# Altium schematic sheet Driver.SchDoc
size A
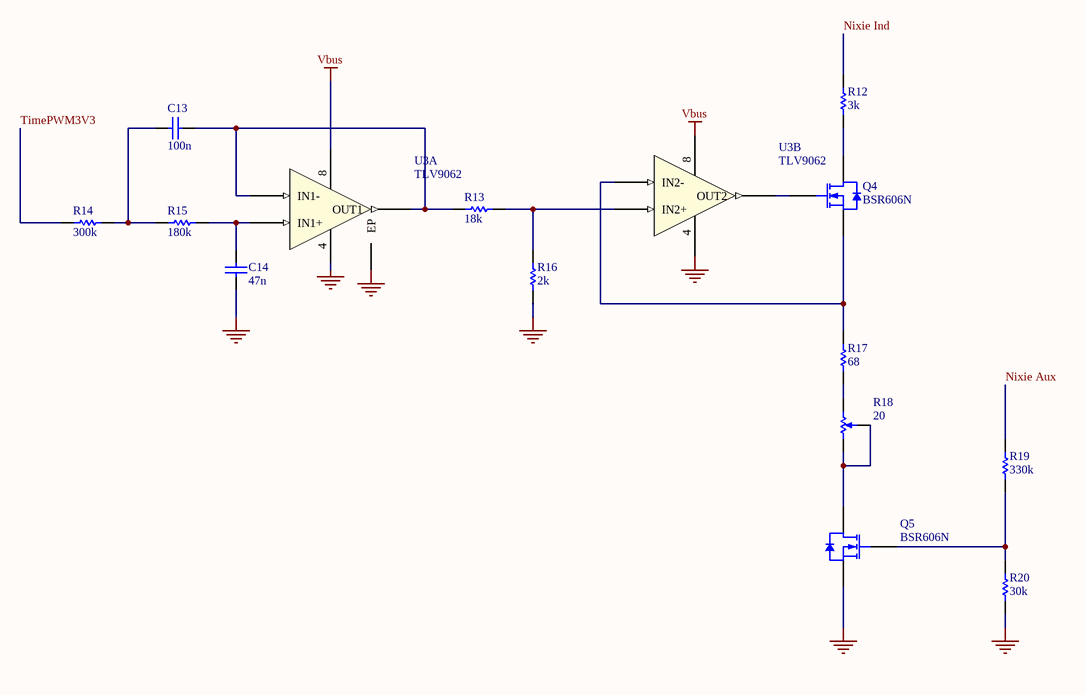
[diagram p0: Driver.SchDoc]

## Parts
C13  100n  [CAPC0402(1005)60_N]
C14  47n  [CAPC0402(1005)60_N]
Q4  BSR606N  [INF-PG-SC59_N]
Q5  BSR606N  [INF-PG-SC59_N]
R12  3k  [RESC0402(1005)_N]
R13  18k  [RESC0402(1005)_N]
R14  300k  [RESC0402(1005)_N]
R15  180k  [RESC0402(1005)_N]
R16  2k  [RESC0402(1005)_N]
R17  68  [RESC0402(1005)_N]
R18  20  [PVG3A]
R19  330k  [RESC0402(1005)_N]
R20  30k  [RESC0402(1005)_N]
U3  TLV9062  [WSON-8]  (parts A,B of 2)

## Nets
GND: C14.1 Q5.2(SOURCE) R16.1 R20.1 U3.4(V-) U3.9(EP)
Vbus: U3.8(V+)
Nixie Aux: R19.2
Nixie Ind: R12.2
TimePWM3V3: R14.1
NetC13_1: C13.1 R14.2 R15.1
NetC13_2: C13.2 R13.1 U3.1(OUT1) U3.2(IN1-)
NetC14_2: C14.2 R15.2 U3.3(IN1+)
NetQ4_1: Q4.1(GATE) U3.7(OUT2)
NetQ4_2: Q4.2(SOURCE) R17.2 U3.6(IN2-)
NetQ4_3: Q4.3(DRAIN) R12.1
NetQ5_1: Q5.1(GATE) R19.1 R20.2
NetQ5_3: Q5.3(DRAIN) R18.1 R18.2
NetR13_2: R13.2 R16.2 U3.5(IN2+)
NetR17_1: R17.1 R18.3

## Library data of the parts
C13 = AC0402KRX7R7BB104: CAP CER 0.1UF 16V X7R 0402; Manufacturer: Yageo; Tolerance: ±10%; Supplier 1: Digi-Key; Manufacturer Part Number: AC0402KRX7R7BB104; RoHS: RoHS Compliant; Category: Capacitors; Stock 1: 29133; Pricing 1: 1=0.1, 10=0.068, 100=0.0304, 500=0.02174, 1000=0.01708, 2500=0.01553, 5000=0.01429 (USD); Packaging: Cut Tape (CT); Part Status: Active; Voltage - Rated: 16V; Temperature Coefficient: X7R; Operating Temperature: -55°C ~ 125°C; Features: -; Ratings: AEC-Q200; Applications: Automotive; Failure Rate: -; Mounting Type: Surface Mount, MLCC; Package / Case: 0402 (1005 Metric); Size / Dimension: 0.039" L x 0.020" W (1.00mm x 0.50mm); Height - Seated (Max): -; Thickness (Max): 0.022" (0.55mm); Lead Spacing: -; Lead Style: -; ComponentLink1URL: http://www.yageo.com/documents/recent/UPY-AC_NP0X7R_16V-to-630V_11.pdf; ComponentLink1Description: http://www.yageo.com/documents/recent/UPY-AC_NP0X7R_16V-to-630V_11.pdf; Supplier Part Number 1: 311-3026-1-ND
C14 = AC0402KRX7R7BB473: CAP CER 0.047UF 16V X7R 0402; Manufacturer: Yageo; Tolerance: ±10%; Supplier 1: Digi-Key; Manufacturer Part Number: AC0402KRX7R7BB473; RoHS: RoHS Compliant; Category: Capacitors; Stock 1: 7700; Pricing 1: 1=0.13, 10=0.093, 100=0.0416, 500=0.0297, 1000=0.02334, 2500=0.02122, 5000=0.01952 (USD); Packaging: Cut Tape (CT); Part Status: Active; Voltage - Rated: 16V; Temperature Coefficient: X7R; Operating Temperature: -55°C ~ 125°C; Features: -; Ratings: AEC-Q200; Applications: Automotive; Failure Rate: -; Mounting Type: Surface Mount, MLCC; Package / Case: 0402 (1005 Metric); Size / Dimension: 0.039" L x 0.020" W (1.00mm x 0.50mm); Height - Seated (Max): -; Thickness (Max): 0.022" (0.55mm); Lead Spacing: -; Lead Style: -; ComponentLink1URL: http://www.yageo.com/documents/recent/UPY-AC_NP0X7R_16V-to-630V_11.pdf; ComponentLink1Description: http://www.yageo.com/documents/recent/UPY-AC_NP0X7R_16V-to-630V_11.pdf; Supplier Part Number 1: 311-3064-1-ND
Q4 Q5 = BSR606N: N-Channel OptiMOS(TM)-3 Small-Signal-Transistor, 60 V VDS, 2.3 A ID, -55 to 150 degC, PG-SC59, Reel, Green; Manufacturer: Infineon; Manufacturer Part Number: BSR606NH6327XTSA1; ID (max): 2.3Â A; IDpuls (max): 9.1Â A; RthJA (max): 250Â K/W; VDS (max): 60Â V; Green: TRUE; Polarity: FALSE; Ptot (max): 0.5Â W; VGS(th) (min): 1.3Â V; QG: 3.7Â nC; VGS(th) (max): 2.3Â V; Mode: Enhancement; Continuous Drain Current (ID): 2.3A; Drain to Source Voltage (Vdss): 60V; Drain to Source Resistance: 60mR; Max Power Dissipation: 500mW; Input Capacitance: 657pF; Number of Elements: 1; Threshold Voltage: 1.8V; Element Configuration: Single; Gate to Source Voltage (Vgs): 20V; ComponentLink2URL: http://www.infineon.com/dgdl/BSR606N_2+3.pdf?folderId=db3a3043156fd573011622e10b5c1f67&fileId=db3a30433e78ea82013e7ea9a659062b; PackageDescription: 3-Pin Semiconductor Package, 3 x 1.53 mm Body, 0.95 mm Pitch; ComponentLink1Description: Manufacturer URL; PackageVersion: Mar-08; Packing: Reel; PartNumber: BSR606N; DatasheetVersion: Rev. 2.3; ComponentLink1URL: http://www.infineon.com/; ComponentLink2Description: Datasheet; ComponentLink3Description: Package Specification; Mounting: SMD; Mounting Technology: Surface Mount; PackageReference: PG-SC59; ComponentLink3URL: http://www.infineon.com/dgdl/SC59-Package_Overview.pdf?folderId=db3a30431936bc4b01194dc0d34440b0&fileId=db3a30431936bc4b01194dd1aa1d40cf; Halogen-free: TRUE; Supplier 1: Digi-Key; Stock 1: 131; Pricing 1: 1=0.61, 10=0.517, 100=0.3875, 500=0.28416, 1000=0.21958 (USD); Mount: Surface Mount; Case/Package: SC; Number of Pins: 59; Min Operating Temperature: -55°C; Max Operating Temperature: 150°C; Packaging: Tape and Reel; Package Quantity: 3000; Rds On Max: 60mR; Power Dissipation: 500mW; Max Dual Supply Voltage: 60V; REACH SVHC: No SVHC; Lead Free: Lead Free; Halogen Free: Halogen Free; Supplier Part Number 1: BSR606NH6327XTSA1CT-ND
R12 = RC0402FR-073KL: RES SMD 3K OHM 1% 1/16W 0402; Manufacturer: Yageo; Power (Watts): 0.063W, 1/16W; Temperature Coefficient: ±100ppm/°C; Supplier 1: Digi-Key; Manufacturer Part Number: RC0402FR-073KL; RoHS: RoHS Compliant; Category: Resistors; Stock 1: 3701800; Pricing 1: 1=0.1, 10=0.018, 100=0.0076, 1000=0.00356, 2500=0.00313, 5000=0.00263 (USD); Packaging: Cut Tape (CT); Part Status: Active; Tolerance: ±1%; Composition: Thick Film; Features: Moisture Resistant; Operating Temperature: -55°C ~ 155°C; Package / Case: 0402 (1005 Metric); Supplier Device Package: 0402; Size / Dimension: 0.039" L x 0.020" W (1.00mm x 0.50mm); Height - Seated (Max): 0.016" (0.40mm); Failure Rate: -; ComponentLink1URL: http://www.yageo.com/documents/recent/PYu-RC_Group_51_RoHS_L_9.pdf; ComponentLink1Description: http://www.yageo.com/documents/recent/PYu-RC_Group_51_RoHS_L_9.pdf; Supplier Part Number 1: 311-3KLRCT-ND
R13 = RC0402FR-0718KL: RES SMD 18K OHM 1% 1/16W 0402; Manufacturer: Yageo; Power (Watts): 0.063W, 1/16W; Temperature Coefficient: ±100ppm/°C; Supplier 1: Digi-Key; Manufacturer Part Number: RC0402FR-0718KL; RoHS: RoHS Compliant; Category: Resistors; Stock 1: 0; Pricing 1: 1=0.1, 10=0.018, 100=0.0076, 1000=0.00356, 2500=0.00313, 5000=0.00263 (USD); Packaging: Cut Tape (CT); Part Status: Active; Tolerance: ±1%; Composition: Thick Film; Features: Moisture Resistant; Operating Temperature: -55°C ~ 155°C; Package / Case: 0402 (1005 Metric); Supplier Device Package: 0402; Size / Dimension: 0.039" L x 0.020" W (1.00mm x 0.50mm); Height - Seated (Max): 0.016" (0.40mm); Failure Rate: -; ComponentLink1URL: http://www.yageo.com/documents/recent/PYu-RC_Group_51_RoHS_L_9.pdf; ComponentLink1Description: http://www.yageo.com/documents/recent/PYu-RC_Group_51_RoHS_L_9.pdf; Supplier Part Number 1: 311-18.0KLRCT-ND
R14 = RC0402FR-07300KL: RES SMD 300K OHM 1% 1/16W 0402; Manufacturer: Yageo; Power (Watts): 0.063W, 1/16W; Temperature Coefficient: ±100ppm/°C; Supplier 1: Digi-Key; Manufacturer Part Number: RC0402FR-07300KL; RoHS: RoHS Compliant; Category: Resistors; Stock 1: 1397022; Pricing 1: 1=0.1, 10=0.018, 100=0.0076, 1000=0.00356, 2500=0.00313, 5000=0.00263 (USD); Packaging: Cut Tape (CT); Part Status: Active; Tolerance: ±1%; Composition: Thick Film; Features: Moisture Resistant; Operating Temperature: -55°C ~ 155°C; Package / Case: 0402 (1005 Metric); Supplier Device Package: 0402; Size / Dimension: 0.039" L x 0.020" W (1.00mm x 0.50mm); Height - Seated (Max): 0.016" (0.40mm); Failure Rate: -; ComponentLink1URL: http://www.yageo.com/documents/recent/PYu-RC_Group_51_RoHS_L_9.pdf; ComponentLink1Description: http://www.yageo.com/documents/recent/PYu-RC_Group_51_RoHS_L_9.pdf; Supplier Part Number 1: 311-300KLRCT-ND
R15 = RC0402FR-07180KL: RES SMD 180K OHM 1% 1/16W 0402; Manufacturer: Yageo; Power (Watts): 0.063W, 1/16W; Temperature Coefficient: ±100ppm/°C; Supplier 1: Digi-Key; Manufacturer Part Number: RC0402FR-07180KL; RoHS: RoHS Compliant; Category: Resistors; Stock 1: 0; Pricing 1: 1=0.1, 10=0.018, 100=0.0076, 1000=0.00356, 2500=0.00313, 5000=0.00263 (USD); Packaging: Cut Tape (CT); Part Status: Active; Tolerance: ±1%; Composition: Thick Film; Features: Moisture Resistant; Operating Temperature: -55°C ~ 155°C; Package / Case: 0402 (1005 Metric); Supplier Device Package: 0402; Size / Dimension: 0.039" L x 0.020" W (1.00mm x 0.50mm); Height - Seated (Max): 0.016" (0.40mm); Failure Rate: -; ComponentLink1URL: http://www.yageo.com/documents/recent/PYu-RC_Group_51_RoHS_L_9.pdf; ComponentLink1Description: http://www.yageo.com/documents/recent/PYu-RC_Group_51_RoHS_L_9.pdf; Supplier Part Number 1: 311-180KLRCT-ND
R16 = RC0402FR-072KL: RES SMD 2K OHM 1% 1/16W 0402; Manufacturer: Yageo; Power (Watts): 0.063W, 1/16W; Temperature Coefficient: ±100ppm/°C; Supplier 1: Digi-Key; Manufacturer Part Number: RC0402FR-072KL; RoHS: RoHS Compliant; Category: Resistors; Stock 1: 8929494; Pricing 1: 1=0.1, 10=0.018, 100=0.0076, 1000=0.00356, 2500=0.00313, 5000=0.00263 (USD); Packaging: Cut Tape (CT); Part Status: Active; Tolerance: ±1%; Composition: Thick Film; Features: Moisture Resistant; Operating Temperature: -55°C ~ 155°C; Package / Case: 0402 (1005 Metric); Supplier Device Package: 0402; Size / Dimension: 0.039" L x 0.020" W (1.00mm x 0.50mm); Height - Seated (Max): 0.016" (0.40mm); Failure Rate: -; ComponentLink1URL: http://www.yageo.com/documents/recent/PYu-RC_Group_51_RoHS_L_9.pdf; ComponentLink1Description: http://www.yageo.com/documents/recent/PYu-RC_Group_51_RoHS_L_9.pdf; Supplier Part Number 1: 311-2KLRCT-ND
R17 = RC0402FR-0768RL: RES SMD 68 OHM 1% 1/16W 0402; Manufacturer: Yageo; Power (Watts): 0.063W, 1/16W; Temperature Coefficient: ±100ppm/°C; Supplier 1: Digi-Key; Manufacturer Part Number: RC0402FR-0768RL; RoHS: RoHS Compliant; Category: Resistors; Stock 1: 0; Pricing 1: 1=0.1, 10=0.018, 100=0.0073, 1000=0.00329, 2500=0.00286, 5000=0.00236 (USD); Packaging: Cut Tape (CT); Part Status: Active; Tolerance: ±1%; Composition: Thick Film; Features: Moisture Resistant; Operating Temperature: -55°C ~ 155°C; Package / Case: 0402 (1005 Metric); Supplier Device Package: 0402; Size / Dimension: 0.039" L x 0.020" W (1.00mm x 0.50mm); Height - Seated (Max): 0.016" (0.40mm); Failure Rate: -; ComponentLink1URL: http://www.yageo.com/documents/recent/PYu-RC_Group_51_RoHS_L_9.pdf; ComponentLink1Description: http://www.yageo.com/documents/recent/PYu-RC_Group_51_RoHS_L_9.pdf; Supplier Part Number 1: 311-68.0LRCT-ND
R18 = PVG3A200C01R00: TRIMMER 20 OHM 0.25W J LEAD TOP; Manufacturer: Bourns Inc.; Power (Watts): 0.25W, 1/4W; Tolerance: ±20%; Temperature Coefficient: ±150ppm/°C; Adjustment Type: Top Adjustment; Resistive Material: Cermet; Supplier 1: Digi-Key; Manufacturer Part Number: PVG3A200C01R00; RoHS: RoHS Compliant; Category: Potentiometers, Variable Resistors; Stock 1: 42863; Pricing 1: 1=1.57, 10=1.386, 25=1.2476, 50=1.2012, 100=1.155, 250=1.08572, 500=0.924 (USD); Packaging: Cut Tape (CT); Part Status: Active; Mounting Type: Surface Mount; Termination Style: J Lead; Size / Dimension: Rectangular - 0.142" x 0.134" Face x 0.079" H (3.60mm x 3.40mm x 2.00mm); ComponentLink1URL: https://www.bourns.com/docs/Product-Datasheets/pvg3.pdf; ComponentLink1Description: https://www.bourns.com/docs/Product-Datasheets/pvg3.pdf; Supplier Part Number 1: 490-2647-1-ND
R19 = RC0402FR-07330KL: RES SMD 330K OHM 1% 1/16W 0402; Manufacturer: Yageo; Power (Watts): 0.063W, 1/16W; Temperature Coefficient: ±100ppm/°C; Supplier 1: Digi-Key; Manufacturer Part Number: RC0402FR-07330KL; RoHS: RoHS Compliant; Category: Resistors; Stock 1: 1954423; Pricing 1: 1=0.1, 10=0.018, 100=0.0076, 1000=0.00356, 2500=0.00313, 5000=0.00263 (USD); Packaging: Cut Tape (CT); Part Status: Active; Tolerance: ±1%; Composition: Thick Film; Features: Moisture Resistant; Operating Temperature: -55°C ~ 155°C; Package / Case: 0402 (1005 Metric); Supplier Device Package: 0402; Size / Dimension: 0.039" L x 0.020" W (1.00mm x 0.50mm); Height - Seated (Max): 0.016" (0.40mm); Failure Rate: -; ComponentLink1URL: http://www.yageo.com/documents/recent/PYu-RC_Group_51_RoHS_L_9.pdf; ComponentLink1Description: http://www.yageo.com/documents/recent/PYu-RC_Group_51_RoHS_L_9.pdf; Supplier Part Number 1: 311-330KLRCT-ND
R20 = RC0402FR-0730KL: RES SMD 30K OHM 1% 1/16W 0402; Manufacturer: Yageo; Power (Watts): 0.063W, 1/16W; Temperature Coefficient: ±100ppm/°C; Supplier 1: Digi-Key; Manufacturer Part Number: RC0402FR-0730KL; RoHS: RoHS Compliant; Category: Resistors; Stock 1: 3148260; Pricing 1: 1=0.1, 10=0.018, 100=0.0076, 1000=0.00356, 2500=0.00313, 5000=0.00263 (USD); Packaging: Cut Tape (CT); Part Status: Active; Tolerance: ±1%; Composition: Thick Film; Features: Moisture Resistant; Operating Temperature: -55°C ~ 155°C; Package / Case: 0402 (1005 Metric); Supplier Device Package: 0402; Size / Dimension: 0.039" L x 0.020" W (1.00mm x 0.50mm); Height - Seated (Max): 0.016" (0.40mm); Failure Rate: -; ComponentLink1URL: http://www.yageo.com/documents/recent/PYu-RC_Group_51_RoHS_L_9.pdf; ComponentLink1Description: http://www.yageo.com/documents/recent/PYu-RC_Group_51_RoHS_L_9.pdf; Supplier Part Number 1: 311-30.0KLRCT-ND
U3 = TLV9062IDSGR: CMOS Amplifier 2 Circuit Rail-to-Rail 8-WSON (2x2); Manufacturer: Texas Instruments; Slew Rate: 6.5 V/µs; Current - Supply: 538µA; Voltage - Supply, Single/Dual (±): 1.8 V ~ 5.5 V; Supplier 1: Digi-Key; Manufacturer Part Number: TLV9062IDSGR; RoHS: RoHS Compliant; Category: Integrated Circuits (ICs); Stock 1: 2198; Pricing 1: 1=0.65, 10=0.556, 100=0.4153, 500=0.3263, 1000=0.25214 (USD); Packaging: Cut Tape (CT); Part Status: Active; Amplifier Type: CMOS; Output Type: Rail-to-Rail; Operating Temperature: -40°C ~ 125°C (TA); Mounting Type: Surface Mount; Package / Case: 8-WFDFN Exposed Pad; Supplier Device Package: 8-WSON (2x2); ComponentLink1URL: http://www.ti.com/lit/ds/symlink/tlv9062.pdf; ComponentLink1Description: http://www.ti.com/lit/ds/symlink/tlv9062.pdf; Supplier Part Number 1: 296-50013-1-ND